# Altium project APP2.PrjPcb
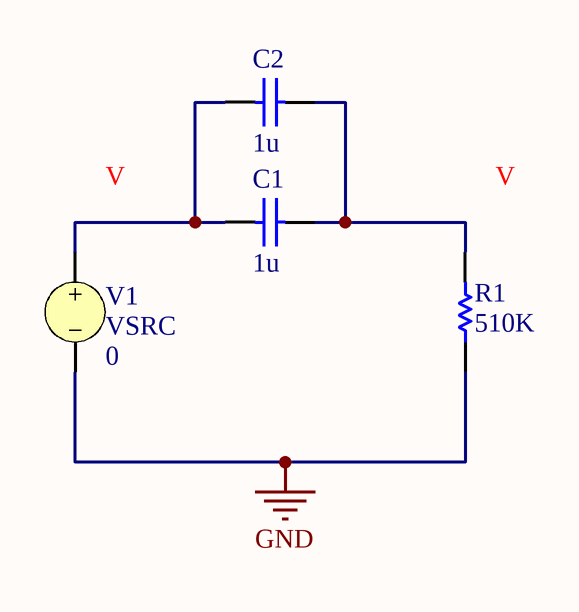
[diagram p0: Filtre Passe-Haut.SchDoc]
3 sheets, 13 parts. Net scope: global (net labels, ports and power ports of the same name join across sheets).
Sheets:
  Filtre Passe-Haut.SchDoc
  Filtre Passe-Bas.SchDoc
  Filtres Passe-Haut + Passe-Bas.SchDoc

## Sheet Filtre Passe-Haut.SchDoc
size A4; SheetNumber: 1; SheetTotal: 2

### Parts
(Parts that share a designator on the sheet are numbered #1, #2 ... from top to bottom, then left to right.)
C1#1  value 1u  (hidden comment: Capacitor)
C2#1  value 1u  (hidden comment: Capacitor)
R1#1  value 510K  (hidden comment: Resistor)
V1#1  VSRC  DC Magnitude: 0

### Nets
GND: R1#1.1 V1#1.2
NetC1#1_1: C1#1.1 C2#1.2 R1#1.2
NetC1#1_2: C1#1.2 C2#1.1 V1#1.1

### Library data of the parts
C1#1 C2#1 = Capacitor: SimulationGenericComponent: True
R1#1 = Resistor: TC1: 0; SimulationGenericComponent: True; TC2: 0
V1#1 = VSRC: Voltage Source; Note: PCB Footprint - Not required; Amplitude: 3; Frequency: 15; Published: 30-July-2020; LatestRevisionDate: 30-July-2020; LatestRevisionNote: Re-released for DXP Platform.; PackageReference: Not Applicable; Publisher: Altium Limited; AC Magnitude: 0; AC Phase: 0; Offset: 0; Delay: 0; Damping Factor: 0; Phase: 0

## Sheet Filtre Passe-Bas.SchDoc
size A4; SheetNumber: 2; SheetTotal: 2
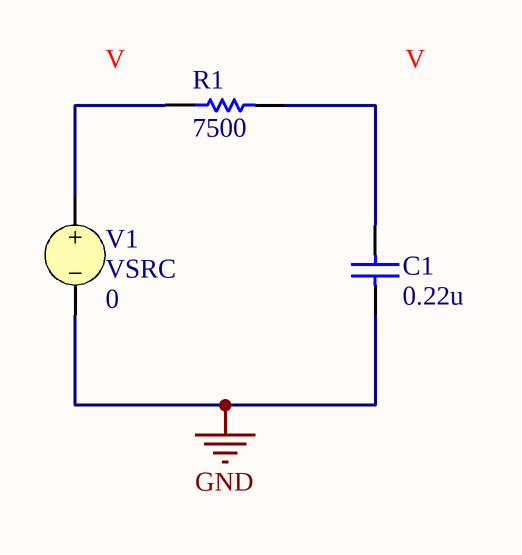
[diagram p1: Filtre Passe-Bas.SchDoc]

### Parts
(Parts that share a designator on the sheet are numbered #1, #2 ... from top to bottom, then left to right.)
C1#2  value 0.22u  (hidden comment: Capacitor)
R1#2  value 7500  (hidden comment: Resistor)
V1#2  VSRC  DC Magnitude: 0

### Nets
GND: C1#2.1 V1#2.2
NetC1#2_2: C1#2.2 R1#2.2
NetR1#2_1: R1#2.1 V1#2.1

### Library data of the parts
C1#2 = Capacitor: SimulationGenericComponent: True
R1#2 = Resistor: TC1: 0; SimulationGenericComponent: True; TC2: 0
V1#2 = VSRC: Voltage Source; Note: PCB Footprint - Not required; Amplitude: 3; Frequency: 10k; Published: 30-July-2020; LatestRevisionDate: 30-July-2020; LatestRevisionNote: Re-released for DXP Platform.; PackageReference: Not Applicable; Publisher: Altium Limited; AC Magnitude: 0; AC Phase: 0; Offset: 0; Delay: 0; Damping Factor: 0; Phase: 0

## Sheet Filtres Passe-Haut + Passe-Bas.SchDoc
size A4; SheetNumber: 3; SheetTotal: 3
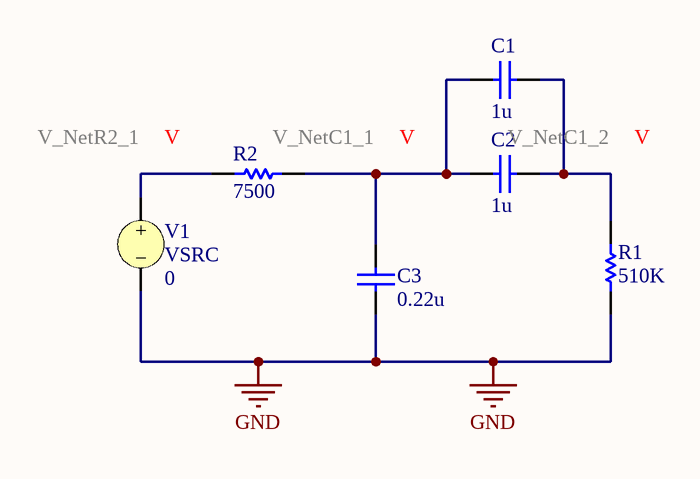
[diagram p2: Filtres Passe-Haut + Passe-Bas.SchDoc]

### Parts
(Parts that share a designator on the sheet are numbered #1, #2 ... from top to bottom, then left to right.)
C1#3  value 1u  (hidden comment: Capacitor)
C2#2  value 1u  (hidden comment: Capacitor)
C3  value 0.22u  (hidden comment: Capacitor)
R1#3  value 510K  (hidden comment: Resistor)
R2  value 7500  (hidden comment: Resistor)
V1#3  VSRC  DC Magnitude: 0

### Nets
GND: C3.1 R1#3.1 V1#3.2
NetC1#3_1: C1#3.1 C2#2.2 C3.2 R2.2
NetC1#3_2: C1#3.2 C2#2.1 R1#3.2
NetR2_1: R2.1 V1#3.1

### Library data of the parts
C1#3 C2#2 C3 = Capacitor: SimulationGenericComponent: True
R1#3 R2 = Resistor: TC1: 0; SimulationGenericComponent: True; TC2: 0
V1#3 = VSRC: Voltage Source; Note: PCB Footprint - Not required; Amplitude: 3; Frequency: 10K; Published: 30-July-2020; LatestRevisionDate: 30-July-2020; LatestRevisionNote: Re-released for DXP Platform.; PackageReference: Not Applicable; Publisher: Altium Limited; AC Magnitude: 0; AC Phase: 0; Offset: 0; Delay: 0; Damping Factor: 0; Phase: 0

## Nets that join several sheets
GND: Filtre Passe-Haut (R1#1.1 V1#1.2), Filtre Passe-Bas (C1#2.1 V1#2.2), Filtres Passe-Haut + Passe-Bas (C3.1 R1#3.1 V1#3.2)